# Altium schematic sheet Sheet.SchDoc
size 381 x 241 mm; SheetNumber: 1; SheetTotal: 1
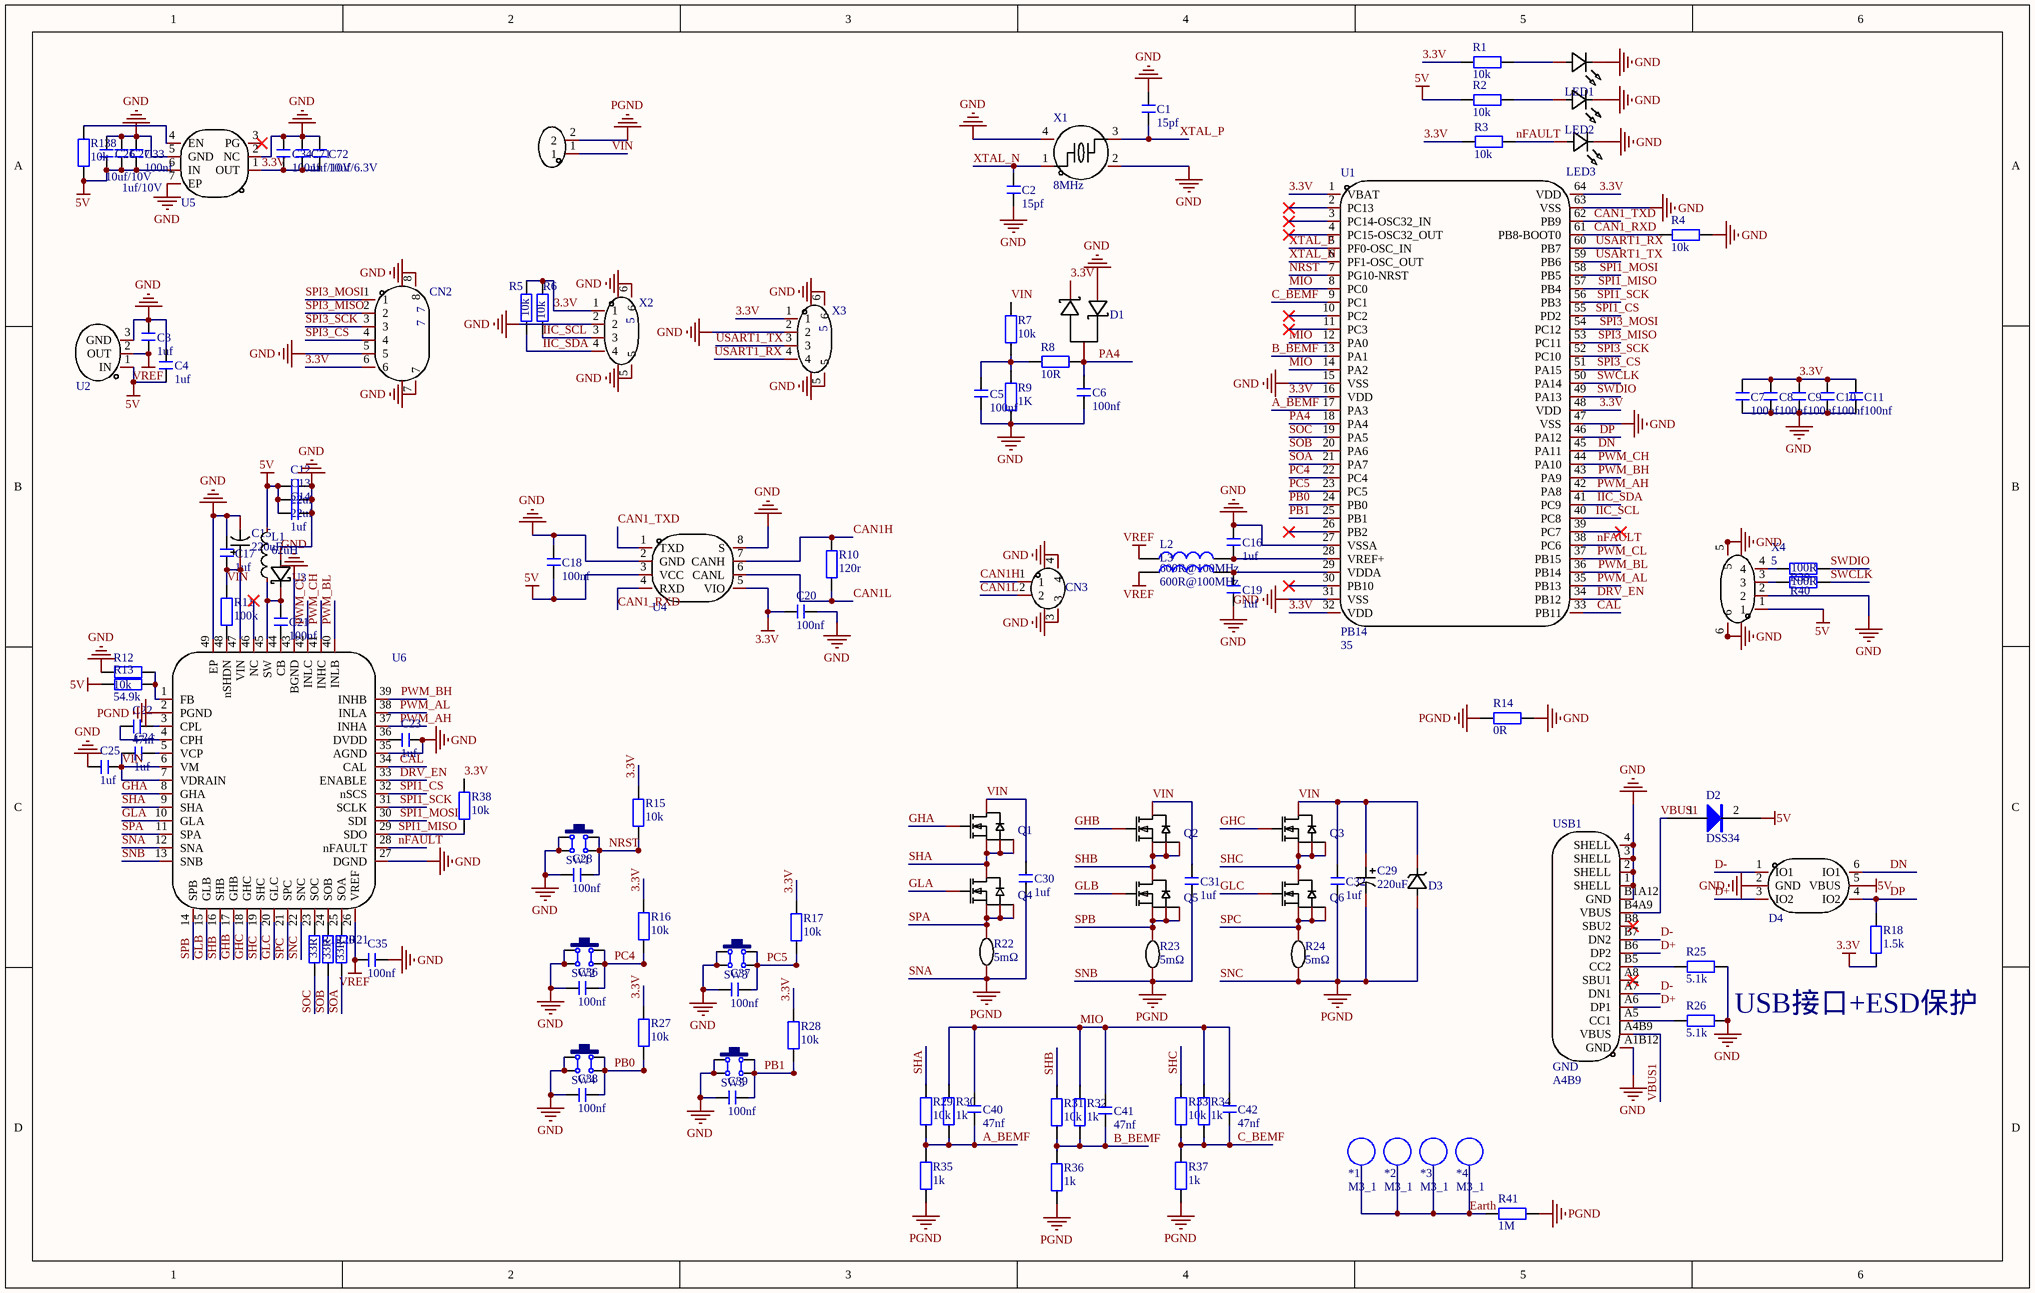
[diagram p0: Sheet.SchDoc]

## Parts
*1  M3_1  [M3 125X250]
*2  M3_1  [M3 125X250]
*3  M3_1  [M3 125X250]
*4  M3_1  [M3 125X250]
C1  15pf  [C0402]
C2  15pf  [C0402]
C3  1uf  [C0402]
C4  1uf  [C0402]
C5  100nf  [C0402]
C6  100nf  [C0402]
C7  100nf  [C0402]
C8  100nf  [C0402]
C9  100nf  [C0402]
C10  100nf  [C0402]
C11  100nf  [C0402]
C12  22uf  [C0402]
C13  22uf  [C0402]
C14  1uf  [C0402]
C15  value 220uF  [CAP 2.5*5*11]  (hidden comment: PA50V220M10x12)
C16  1uf  [C0402]
C17  1uf  [C1206]
C18  100nf  [C0402]
C19  1uf  [C0402]
C20  100nf  [C0402]
C21  100nf  [C0402]
C22  47nf  [C0402]
C23  1uf  [C0402]
C24  1uf  [C0402]
C25  1uf  [C0402]
C26  10uf/10V  [C0603]
C27  1uf/10V  [C0402]
C28  100nf  [C0402]
C29  value 220uF  [CAP-TH_BD10.0-P5.00-D0.6-FD_2]  (hidden comment: PA50V220M10x12)
C30  1uf  [C1206]
C31  1uf  [C1206]
C32  1uf  [C1206]
C33  100nf  [C0402]
C34  100nf  [C0402]
C35  100nf  [C0402]
C36  100nf  [C0402]
C37  100nf  [C0402]
C38  100nf  [C0402]
C39  100nf  [C0402]
C40  47nf  [C0402]
C41  47nf  [C0402]
C42  47nf  [C0402]
C71  1uf/10V  [C0402]
C72  10uf/6.3V  [C0603]
CN1  XT30U-M  [CONN-TH_XT30U-M]  (value not drawn)
CN2  NAME: 7  [CONN-SMD_A1257WR-S-6P]  (hidden comment: A1257WR-S-6P)
CN3  GH125-S02DCA-00  [GH1.25-2P-卧贴]  (value not drawn)
D1  LBAT54SLT1G  [SOT-23_L2.9-W1.3-P1.90-LS2.4-BR]  (value not drawn)
D2  DSS34  [SOD-123]
D3  SMBJ60A_C49066953  [SMB_L4.5-W3.7-LS5.4-RD]  (value not drawn)
D4  USBLC6-2SC6_C2827654  [SOT-23-6_L2.9-W1.6-P0.95-LS2.8-BL]  (value not drawn)
L1  value 62uH  [IND-SMD_L4.0-W4.0_FNR40XXS]  (hidden comment: FNR4020S620MT)
L2  600R@100MHz  [L0603]
L3  600R@100MHz  [L0603]
LED1  XL-1005SURC  [LED0402-R-RD_RED]  (value not drawn)
LED2  XL-1005SURC  [LED0402-R-RD_RED]  (value not drawn)
LED3  XL-1005SURC  [LED0402-R-RD_RED]  (value not drawn)
Q1  NCEP0160AG  [DFN-5_L4.9-W5.9-P1.27-LS6.2-BL]  (value not drawn)
Q2  NCEP0160AG  [DFN-5_L4.9-W5.9-P1.27-LS6.2-BL]  (value not drawn)
Q3  NCEP0160AG  [DFN-5_L4.9-W5.9-P1.27-LS6.2-BL]  (value not drawn)
Q4  NCEP0160AG  [DFN-5_L4.9-W5.9-P1.27-LS6.2-BL]  (value not drawn)
Q5  NCEP0160AG  [DFN-5_L4.9-W5.9-P1.27-LS6.2-BL]  (value not drawn)
Q6  NCEP0160AG  [DFN-5_L4.9-W5.9-P1.27-LS6.2-BL]  (value not drawn)
R1  10k  [R0402]
R2  10k  [R0402]
R3  10k  [R0402]
R4  10k  [R0402]
R5  10k  [R0402]
R6  10k  [R0402]
R7  10k  [R0402]
R8  10R  [R0402]
R9  1K  [R0402]
R10  120r  [R0402]
R11  100k  [R0402]
R12  10k  [R0402]
R13  54.9k  [R0402]
R14  0R  [0805R]
R15  10k  [R0402]
R16  10k  [R0402]
R17  10k  [R0402]
R18  1.5k  [R0402]
R19  33R  [R0402]
R20  33R  [R0402]
R21  33R  [R0402]
R22  value 5mΩ  [R2512]  (hidden comment: HoYLR2512-2W-5mR-1%)
R23  value 5mΩ  [R2512]  (hidden comment: HoYLR2512-2W-5mR-1%)
R24  value 5mΩ  [R2512]  (hidden comment: HoYLR2512-2W-5mR-1%)
R25  5.1k  [R0402]
R26  5.1k  [R0402]
R27  10k  [R0402]
R28  10k  [R0402]
R29  10k  [R0402]
R30  1k  [R0402]
R31  10k  [R0402]
R32  1k  [R0402]
R33  10k  [R0402]
R34  1k  [R0402]
R35  1k  [R0402]
R36  1k  [R0402]
R37  1k  [R0402]
R38  10k  [R0402]
R39  100R  [R0402]
R40  100R  [R0402]
R41  1M  [0805R]
R138  10k  [R0402]
SW1  smd-4*4*1.5  [TSW SMD-4*4*1.5]  (value not drawn)
SW2  smd-4*4*1.5  [TSW SMD-4*4*1.5]  (value not drawn)
SW3  smd-4*4*1.5  [TSW SMD-4*4*1.5]  (value not drawn)
SW4  smd-4*4*1.5  [TSW SMD-4*4*1.5]  (value not drawn)
SW5  smd-4*4*1.5  [TSW SMD-4*4*1.5]  (value not drawn)
U1  NAME: PB14  NUMBER: 35  [LQFP-64_L10.0-W10.0-P0.50-LS12.0-BL]  (hidden comment: STM32G474RET6)
U2  REF3033AIDBZR  [SOT-23-3_L3.0-W1.7-P0.95-LS2.9-BR]  (value not drawn)
U3  DSK16_C22466351  [SOD-123FL_L2.8-W1.9-LS3.7-RD]  (value not drawn)
U4  TJA1051T/3  [SOP-8_L4.9-W3.9-P1.27-LS6.0-BL-1]  (value not drawn)
U5  LP5912-3.3DRVR  [WSON-6_L2.0-W2.0-P0.65-TL-EP]  (value not drawn)
U6  DRV8323RSRGZT  [VQFN-48_L7.0-W7.0-P0.50-BL-EP5.5]  (value not drawn)
USB1  NAME: GND  NUMBER: A4B9  [USB-C-SMD_TYPE-C16PIN]  (hidden comment: TYPE-C16PIN)
X1  value 8MHz  [CRYSTAL-SMD_4P-L3.2-W2.5-BL]  (hidden comment: XL2EL89CSI-111YLC-25M)
X2  NUMBER: 5  [GH1.25-4P-卧贴]  (hidden comment: GH125-S04CCA-00)
X3  NUMBER: 5  [GH1.25-4P-卧贴]  (hidden comment: GH125-S04CCA-00)
X4  NUMBER: 5  [GH1.25-4P-卧贴]  (hidden comment: GH125-S04CCA-00)

## Nets
3.3V: C7.1 C8.1 C9.1 C10.1 C11.1 C20.2 C34.2 C71.2 C72.2 CN2.6 D1.2(K) R1.2 R3.2 R5.2 R6.2 R15.2 R16.2 R17.2 R18.2 R27.2 R28.2 R38.2 U1.1(VBAT) U1.16(VDD) U1.32(VDD) U1.48(VDD) U1.64(VDD) U4.5(VIO) U5.1(OUT) X2.1 X3.1
5V: C4.1 C12.1 C13.1 C14.1 C18.2 C26.2 C27.2 C33.2 D2.2 D4.5(VBUS) L1.2 R2.2 R13.1 R138.1 U2.1(IN) U4.3(VCC) U5.6(IN) X4.1
GND: C1.1 C2.2 C3.2 C4.2 C5.2 C6.2 C7.2 C8.2 C9.2 C10.2 C11.2 C12.2 C13.2 C14.2 C15.2 C16.1 C17.2 C18.1 C19.2 C20.1 C23.2 C25.1 C26.1 C27.1 C28.1 C33.1 C34.1 C35.2 C36.1 C37.1 C38.1 C39.1 C71.1 C72.1 CN2.5 CN2.7 CN2.8 CN3.3 CN3.4 D1.1(A) D4.2(GND) LED1.2(A) LED2.2(A) LED3.2(A) R4.1 R9.1 R12.1 R14.2 R25.1 R26.1 SW1.1 SW1.4 SW2.1 SW2.4 SW3.1 SW3.4 SW4.1 SW4.4 SW5.1 SW5.4 U1.15(VSS) U1.27(VSSA) U1.31(VSS) U1.47(VSS) U1.63(VSS) U2.3(GND) U3.2(A) U4.2(GND) U4.8(S) U5.2(NC) U5.5(GND) U5.7(EP) U6.27(DGND) U6.35(AGND) U6.43(BGND) U6.49(EP) USB1.1(SHELL) USB1.2(SHELL) USB1.3(SHELL) USB1.4(SHELL) USB1.A1B12(GND) USB1.B1A12(GND) X1.2(GND) X1.4(GND) X2.2 X2.5 X2.6 X3.2 X3.5 X3.6 X4.2 X4.5 X4.6
SNA: C29.2 C30.1 C31.1 C32.1 CN1.2 D3.2(A) R14.1 R22.1 R23.1 R24.1 R35.1 R36.1 R37.1 R41.1 U6.2(PGND) U6.12(SNA) U6.13(SNB) U6.22(SNC)  [also labelled PGND, SNB, SNC]
VREF: C3.1 C35.1 L2.1 L3.1 U2.2(OUT) U6.26(VREF)
A_BEMF: C40.1 R29.1 R30.1 R35.2 U1.17(PA3)
B_BEMF: C41.1 R31.1 R32.1 R36.2 U1.13(PA1)
C_BEMF: C42.1 R33.1 R34.1 R37.2 U1.9(PC1)
CAL: U1.33(PB11) U6.34(CAL)
CAN1_RXD: R4.2 U1.61(PB8-BOOT0) U4.4(RXD)
CAN1_TXD: U1.62(PB9) U4.1(TXD)
CAN1H: CN3.1 R10.2 U4.7(CANH)
CAN1L: CN3.2 R10.1 U4.6(CANL)
D+: D4.3(IO2) USB1.A6(DP1) USB1.B6(DP2)
D-: D4.1(IO1) USB1.A7(DN1) USB1.B7(DN2)
DN: D4.6(IO1) U1.45(PA11)
DP: D4.4(IO2) R18.1 U1.46(PA12)
DRV_EN: U1.34(PB12) U6.33(ENABLE)
Earth: *1.1 *2.1 *3.1 *4.1 R41.2
GHA: Q1.4(G) U6.8(GHA)
GHB: Q2.4(G) U6.17(GHB)
GHC: Q3.4(G) U6.18(GHC)
GLA: Q4.4(G) U6.10(GLA)
GLB: Q5.4(G) U6.15(GLB)
GLC: Q6.4(G) U6.20(GLC)
IIC_SCL: R6.1 U1.40(PC8) X2.3
IIC_SDA: R5.1 U1.41(PC9) X2.4
MIO: C40.2 C41.2 C42.2 R30.2 R32.2 R34.2 U1.8(PC0) U1.12(PA0) U1.14(PA2)
nFAULT: LED3.1(K) R3.1 U1.38(PC6) U6.28(nFAULT)
NRST: C28.2 R15.1 SW1.2 SW1.3 U1.7(PG10-NRST)
PA4: C6.1 D1.3(AK) R8.1 U1.18(PA4)
PB0: C38.2 R27.1 SW4.2 SW4.3 U1.24(PB0)
PB1: C39.2 R28.1 SW5.2 SW5.3 U1.25(PB1)
PC4: C36.2 R16.1 SW2.2 SW2.3 U1.22(PC4)
PC5: C37.2 R17.1 SW3.2 SW3.3 U1.23(PC5)
PWM_AH: U1.42(PA8) U6.37(INHA)
PWM_AL: U1.35(PB13) U6.38(INLA)
PWM_BH: U1.43(PA9) U6.39(INHB)
PWM_BL: U1.36(PB14) U6.40(INLB)
PWM_CH: U1.44(PA10) U6.41(INHC)
PWM_CL: U1.37(PB15) U6.42(INLC)
SHA: Q1.1(S) Q1.2(S) Q1.3(S) Q4.5(D) R29.2 U6.9(SHA)
SHB: Q2.1(S) Q2.2(S) Q2.3(S) Q5.5(D) R31.2 U6.16(SHB)
SHC: Q3.1(S) Q3.2(S) Q3.3(S) Q6.5(D) R33.2 U6.19(SHC)
SOA: R21.1 U1.21(PA7)
SOB: R20.1 U1.20(PA6)
SOC: R19.1 U1.19(PA5)
SPA: Q4.1(S) Q4.2(S) Q4.3(S) R22.2 U6.11(SPA)
SPB: Q5.1(S) Q5.2(S) Q5.3(S) R23.2 U6.14(SPB)
SPC: Q6.1(S) Q6.2(S) Q6.3(S) R24.2 U6.21(SPC)
SPI1_CS: U1.55(PD2) U6.32(nSCS)
SPI1_MISO: R38.1 U1.57(PB4) U6.29(SDO)
SPI1_MOSI: U1.58(PB5) U6.30(SDI)
SPI1_SCK: U1.56(PB3) U6.31(SCLK)
SPI3_CS: CN2.4 U1.51(PA15)
SPI3_MISO: CN2.2 U1.53(PC11)
SPI3_MOSI: CN2.1 U1.54(PC12)
SPI3_SCK: CN2.3 U1.52(PC10)
SWCLK: R40.2 U1.50(PA14)
SWDIO: R39.2 U1.49(PA13)
USART1_RX: U1.60(PB7) X3.4
USART1_TX: U1.59(PB6) X3.3
VBUS1: D2.1 USB1.A4B9(VBUS) USB1.B4A9(VBUS)
VIN: C15.1 C17.1 C24.1 C25.2 C29.1 C30.2 C31.2 C32.2 CN1.1 D3.1(K) Q1.5(D) Q2.5(D) Q3.5(D) R7.2 R11.2 U6.6(VM) U6.7(VDRAIN) U6.47(VIN)
XTAL_N: C2.1 U1.6(PF1-OSC_OUT) X1.1
XTAL_P: C1.2 U1.5(PF0-OSC_IN) X1.3
NetC5_1: C5.1 R7.1 R8.2 R9.2
NetC16_2: C16.2 L2.2 U1.28(VREF+)
NetC19_1: C19.1 L3.2 U1.29(VDDA)
NetC21_1: C21.1 U6.44(CB)
NetC21_2: C21.2 L1.1 U3.1(K) U6.45(SW)
NetC22_1: C22.1 U6.4(CPH)
NetC22_2: C22.2 U6.3(CPL)
NetC23_1: C23.1 U6.36(DVDD)
NetC24_2: C24.2 U6.5(VCP)
NetLED1_1: LED1.1(K) R1.1
NetLED2_1: LED2.1(K) R2.1
NetR11_1: R11.1 U6.48(nSHDN)
NetR12_2: R12.2 R13.2 U6.1(FB)
NetR19_2: R19.2 U6.23(SOC)
NetR20_2: R20.2 U6.24(SOB)
NetR21_2: R21.2 U6.25(SOA)
NetR25_2: R25.2 USB1.B5(CC2)
NetR26_2: R26.2 USB1.A5(CC1)
NetR39_1: R39.1 X4.4
NetR40_1: R40.1 X4.3
NetR138_2: R138.2 U5.4(EN)

Not connected (* = marked no-connect by the designer): U1 2(PC13)* 3(PC14-OSC32_IN)* 4(PC15-OSC32_OUT)* 10(PC2)* 11(PC3)* 26(PB2)* 30(PB10)* 39(PC7)*; U5 3(PG)*; U6 46(NC)*; USB1 A8(SBU1)* B8(SBU2)*

## Notes on the sheet
- USB接口+ESD保护

## Library data of the parts
*1-*4 = M3_1: 铜柱孔; 版权归属: 源创客; BOM名称: 铜柱孔; 学习资源: www.ooocke.com
C1-C14 C16-C28 C30-C42 C71 C72 = C: 无极性电容; BOM名称: 无极性贴片电容; 版权归属: 源创客; 学习资源: www.ooocke.com
C15 C29 = 电解电容M10*12: 容值:220uF;精度:±20%;额定电压:50V;纹波电流:3.5A@100kHz;等效串联电阻(ESR):20mΩ@100kHz;类型:聚合物;; Manufacturer: JIERR(捷而瑞); Add into BOM: yes; Tolerance: ±20%; Voltage Rating: 50V; Type: 聚合物; Lifetime: 2000hrs@105; Symbol: PA50V220M10X12; Device: PA50V220M10x12; LCSC Part Name: 220uF ±20% 50V; Supplier Part: C46550451; Manufacturer Part: PA50V220M10x12; Supplier Footprint: 插件,D10xL12.5mm; JLCPCB Part Class: Extended Part; Datasheet: https://item.szlcsc.com/datasheet/PA50V220M10x12/48680145.html; Supplier: LCSC; Convert to PCB: yes; Ripple Current: 3.5A@100kHz; Equivalent Series Resistance(ESR): 20mΩ@100kHz; Diameter: 10mm; Height - Seated (Max): 12.5mm; Operating Temperature: -55~+105
CN1 = XT30U-M: Manufacturer: AMASS(艾迈斯); Add into BOM: yes; Name: XT30U-M; Symbol: XT30U-M; Device: XT30U-M; LCSC Part Name: XT30U-M 公头; Supplier Part: C99101; Manufacturer Part: XT30U-M; Supplier Footprint: -; JLCPCB Part Class: Extended Part; Datasheet: https://atta.szlcsc.com/upload/public/pdf/source/20170606/1496716542582.pdf; Supplier: LCSC; Convert to PCB: yes
CN2 = GH1.25-6P: 插针结构:1x6P;间距:1.25mm;安装方式:-;行距:-;总PIN数:6P;排数:1;每排PIN数:6;参考系列:GH;触头材质:黄铜;; Manufacturer: CJT(长江连接器); Add into BOM: yes; Pins Structure: 1x6P; Pitch: 1.25mm; Number of PINs Per Row: 6; Reference Series: GH; Symbol: A1257WR-S-6P; Device: A1257WR-S-6P; LCSC Part Name: 1x6P 间距:1.25mm 系列:GH 镀锡; Supplier Part: C225129; Manufacturer Part: A1257WR-S-6P; Supplier Footprint: SMD,P=1.25mm; JLCPCB Part Class: Extended Part; Datasheet: https://atta.szlcsc.com/upload/public/pdf/source/20181008/C272994_C9E89FA8A36D0009CAD30AD8C59C2782.pdf; Supplier: LCSC; Convert to PCB: yes; Mounting Style: -; Row Spacing: -; Number of Pins: 6P; Number of Rows: 1; Contact Material: 黄铜; NUMBER: 7
CN3 = GH125-2p: Manufacturer: JS(钜硕电子); Add into BOM: yes; Pitch: 1.25mm; Pins Structure: 1x2P; Number of PINs Per Row: 2; Gender: 公型插针; Current Rating (Max): 1A; Name: GH125-S02DCA-00; Symbol: GH125-S02DCA-00; Device: GH125-S02DCA-00; LCSC Part Name: GH1.25卧式贴片 带扣; Supplier Part: C2886765; Manufacturer Part: GH125-S02DCA-00; Supplier Footprint: SMD,P=1.25mm; JLCPCB Part Class: Extended Part; Datasheet: https://atta.szlcsc.com/upload/public/pdf/source/20210818/CD11791E5ED3EDF45A7009E9C8A2BD4C.pdf; Supplier: LCSC; Convert to PCB: yes; Reference Series: -; Number of Rows: 1; Row Spacing: -; Mounting Style: 卧贴; Operating Temperature Range: -25℃~+85℃
D1 = LBAT54SLT1G: 正向压降(Vf):400mV;直流反向耐压(Vr):30V;整流电流:200mA;; Manufacturer: LRC(乐山无线电); Add into BOM: yes; Voltage - Forward(Vf@If): 400mV; Voltage - DC Reverse(Vr): 30V; Current - Rectified: 200mA; Reverse Leakage Current (Ir): 2uA; Non-Repetitive Peak Forward Surge Current: 600mA; Symbol: LBAT54SLT1G; Device: LBAT54SLT1G; LCSC Part Name: 电压:30V 电流:200mA; Supplier Part: C12765; Manufacturer Part: LBAT54SLT1G; Supplier Footprint: SOT-23; JLCPCB Part Class: Extended Part; Datasheet: https://item.szlcsc.com/datasheet/LBAT54SLT1G/13406.html; Supplier: LCSC; Convert to PCB: yes
D2 = 二极管: Diode 1N series
D3 = SMBJ60A_C49066953: 极性:单向;反向截止电压(Vrwm):60V;钳位电压:96.8V;峰值脉冲电流(Ipp):6.2A;峰值脉冲功率(Ppp):600W;击穿电压:73.7V;; Manufacturer: R+O(宏嘉诚); Add into BOM: yes; Polarity: 单向; Reverse Stand-Off Voltage (Vrwm): 60V; Clamping Voltage: 96.8V; Peak Pulse Current (Ipp): 6.2A; Peak Pulse Power Dissipation (Ppp): 600W; Voltage - Breakdown: 73.7V; Reverse Leakage Current (Ir): 5uA; Number of Channels: 单路; level of protection: IEC 61000-4-2; Type: TVS; Symbol: SMBJ60A_C49066953; Device: SMBJ60A_C49066953; LCSC Part Name: 单向TVS 60V截止 峰值浪涌电流：6.2A; Supplier Part: C49066953; Manufacturer Part: SMBJ60A; Supplier Footprint: SMB(DO-214AA); Datasheet: https://item.szlcsc.com/datasheet/SMBJ60A/51438149.html; Supplier: LCSC; Convert to PCB: yes; Operating Temperature: -55~+150
D4 = USBLC6-2SC6_C2827654: 极性:-;反向截止电压(Vrwm):-;最大钳位电压:-;峰值脉冲电流(Ipp)@10/1000us:-;峰值脉冲功率(Ppp)@10/1000us:-;击穿电压:-;; Manufacturer: TECH PUBLIC(台舟); Add into BOM: yes; Type: ESD; Symbol: USBLC6-2SC6_C2827654; Device: USBLC6-2SC6_C2827654; LCSC Part Name: ESD，可防30kV静电; Supplier Part: C2827654; Manufacturer Part: USBLC6-2SC6; Supplier Footprint: SOT-23-6; Datasheet: https://atta.szlcsc.com/upload/public/pdf/source/20210810/FBD75DE717D6D97BAC6DD7F2B5C09DCD.pdf; Supplier: LCSC; Convert to PCB: yes; polarity: -; Reverse Stand-Off Voltage (Vrwm): -; Maximum Clamping Voltage: -; Peak Pulse Current (Ipp)@10/1000us: -; Peak Pulse Power Dissipation (Ppp)@10/1000us: -; Breakdown Voltage: -; Reverse Leakage Current (Ir): -; Operating Temperature: -
L1 = FNR4020S620MT: 电感值:62uH;精度:±20%;额定电流:520mA;饱和电流(Isat):710mA;类型:磁胶屏蔽电感;; Manufacturer: cjiang(长江微电); Add into BOM: yes; Tolerance: ±20%; Current Rating: 520mA; Current - Saturation(Isat): 710mA; DC Resistance(DCR): 1.17Ω; Type: 磁胶屏蔽电感; Symbol: FNR4020S620MT; Device: FNR4020S620MT; LCSC Part Name: 62uH ±20% 710mA; Supplier Part: C167846; Manufacturer Part: FNR4020S620MT; Supplier Footprint: SMD,4x4mm; JLCPCB Part Class: Extended Part; Datasheet: https://item.szlcsc.com/datasheet/FNR4020S620MT/179229.html; Supplier: LCSC; Convert to PCB: yes
L2 L3 = L_1: 电感; BOM名称: 小功率贴片电感; 版权归属: 源创客; 学习资源: www.ooocke.com
LED1-LED3 = LED_1: 发光颜色:红色;功率:55mW;正向电流:25mA;主波长:620nm;透镜颜色:无色透明透镜;色温:6000K~7000K;发光角度:120°;载带方式:正贴;工作温度:-30~+85;; Manufacturer: XINGLIGHT(成兴光); Add into BOM: yes; Emitted Color: 红色; Power Dissipation: 55mW; Forward Current: 25mA; Dominant Wavelength: 620nm; Peak Wavelength: 625nm; Lens Color: 无色透明透镜; Viewing Angle: 120°; Mounting Sytle: 正贴; Symbol: XL-1005SURC; Device: XL-1005SURC; LCSC Part Name: XL-1005SURC; Supplier Part: C965790; Manufacturer Part: XL-1005SURC; Supplier Footprint: 0402; JLCPCB Part Class: Extended Part; Datasheet: https://atta.szlcsc.com/upload/public/pdf/source/20221102/EBA3AB29C2D5B62EE70B36967F8F8809.pdf; Supplier: LCSC; Convert to PCB: yes; Color Temperature: 6000K~7000K; Operating Temperature: -30~+85
Q1-Q6 = NCEP0160AG: 数量:1个N沟道;漏源电压(Vdss):100V;连续漏极电流(Id):60A;导通电阻(RDS(on)):11mΩ@4.5V,30A;耗散功率(Pd):105W;阈值电压(Vgs(th)):1V;; Manufacturer: NCE(无锡新洁能); Add into BOM: yes; Number: 1个N沟道; Drain to Source Voltage: 100V; Current - Continuous Drain(Id): 60A; Pd - Power Dissipation: 105W; Gate Threshold Voltage (Vgs(th)): 1V; Gate Charge(Qg): 65nC@50V; Input Capacitance(Ciss): 4.2nF@50V; Reverse Transfer Capacitance (Crss@Vds): 23pF; Symbol: NCEP0160AG; Device: NCEP0160AG; LCSC Part Name: 1个N沟道 耐压:100V 电流:60A; Supplier Part: C503012; Manufacturer Part: NCEP0160AG; Supplier Footprint: DFN5X6-8L; JLCPCB Part Class: Extended Part; Datasheet: https://item.szlcsc.com/datasheet/NCEP0160AG/515533.html; Supplier: LCSC; Convert to PCB: yes; RDS(on): 11mΩ@4.5V,30A; Operating Temperature: -55~+150
R1-R21 R25-R41 R138 = R: 电阻; BOM名称: 贴片电阻; 版权归属: 源创客; 学习资源: www.ooocke.com
R22-R24 = HoYLR2512-2W-5mR-1%: 电阻类型:采样电阻;阻值:5mΩ;精度:±1%;功率:2W;安装方式:贴片;; Manufacturer: Milliohm(毫欧); Add into BOM: yes; Tolerance: ±1%; Power(Watts): 2W; Mounting Sytle: 贴片; Symbol: HOYLR2512-2W-5MR-1%; Device: HoYLR2512-2W-5mR-1%; LCSC Part Name: 5mΩ ±1% 2W; Supplier Part: C5375417; Manufacturer Part: HoYLR2512-2W-5mR-1%; Supplier Footprint: 2512; JLCPCB Part Class: Extended Part; Datasheet: https://atta.szlcsc.com/upload/public/pdf/source/20230506/030C75DA7C4694D1A0A3C5A1E352E2F2.pdf; Supplier: LCSC; Convert to PCB: yes; Type: 采样电阻
SW1-SW5 = TSW DIP-6x6: 轻触开关; BOM名称: 直插6x6轻触开关; 版权归属: 源创客; 学习资源: www.ooocke.com
U1 = STM32G474RET6: CPU内核:ARM-M4;CPU最大主频:170MHz;应用领域:-;; Manufacturer: ST(意法半导体); Add into BOM: yes; CPU Core: ARM-M4; CPU Maximum Speed: 170MHz; Program Storage Size: 512KB; Program Memory Type: FLASH; Number of I/O: 52; ADC (Bit): 12bit; Voltage - Supply: 1.71V~3.6V; Symbol: STM32G474RET6; Device: STM32G474RET6; LCSC Part Name: 带DSP和FPU的170MHz主流ARM Cortex-M4 MCU，具有512 KB Flash存储器、数学加速器、高分辨率定时器和高模拟电平集成; Supplier Part: C521608; Manufacturer Part: STM32G474RET6; Supplier Footprint: LQFP-64(10x10); JLCPCB Part Class: Extended Part; Datasheet: https://item.szlcsc.com/datasheet/STM32G474RET6/538858.html; Supplier: LCSC; Convert to PCB: yes; DAC (Bit): 12bit; Applications: -
U2 = REF3033AIDBZR: 输出类型:固定;工作电压:3.35V~5.5V;输出电压:3.3V;输出电流:25mA;精度:±0.2%;; Manufacturer: TI(德州仪器); Add into BOM: yes; Output Type: 固定; Output Voltage: 3.3V; Output Current: 25mA; Tolerance: ±0.2%; Temperature Coefficient: 75ppm/; Reference Type: 串联; Quiescent Current: 50uA; Noise - 1/10Hz to 10Hz: 36uVp-p; Noise - 10Hz to 10kHz: 105uVrms; Symbol: REF3033AIDBZR; Device: REF3033AIDBZR; LCSC Part Name: 3.35V~5.5V 串联 50uA 75ppm/; Supplier Part: C36658; Manufacturer Part: REF3033AIDBZR; Supplier Footprint: SOT-23; JLCPCB Part Class: Extended Part; Datasheet: https://www.ti.com/lit/ds/symlink/ref30.pdf; Supplier: LCSC; Convert to PCB: yes; Voltage - Supply: 3.35V~5.5V; Minimum Cathode Current for Regulation: -; Operating Temperature: -40~+125@(Ta)
U3 = DSK16_C22466351: 二极管配置:独立式;正向压降(Vf):700mV@1A;直流反向耐压(Vr):60V;整流电流:1A;; Manufacturer: R+O(宏嘉诚); Manufacturer Part: DSK16; Add into BOM: yes; Diode Configuration: 独立式; Voltage - DC Reverse(Vr): 60V; Current - Rectified: 1A; Reverse Leakage Current (Ir): 200uA@60V; Operating Junction Temperature Range: -55~+150; Non-Repetitive Peak Forward Surge Current: 25A; Symbol: DSK16_C22466351; Device: DSK16_C22466351; LCSC Part Name: 电压:60V 电流:1A; Supplier Part: C22466351; Supplier Footprint: SOD-123FL; JLCPCB Part Class: Extended Part; Datasheet: https://item.szlcsc.com/datasheet/DSK16/24165510.html; Supplier: LCSC; Convert to PCB: yes; Voltage - Forward(Vf@If): 700mV@1A
U4 = TJA1051T/3: Manufacturer: Tokmas(托克马斯); Add into BOM: yes; Symbol: TJA1051T/3; Device: TJA1051T/3; LCSC Part Name: CAN芯片; Supplier Part: C5342108; Manufacturer Part: TJA1051T/3; Supplier Footprint: SOP-8; JLCPCB Part Class: Extended Part; Datasheet: https://atta.szlcsc.com/upload/public/pdf/source/20221230/A2F88B671123D34174A4F40D8F54A86B.pdf; Supplier: LCSC; Convert to PCB: yes
U5 = LP5912-3.3DRVR: 输出类型:固定;最大输入电压:6.5V;输出电压:3.3V;输出电流:500mA;输出极性:正极;; Manufacturer: TI(德州仪器); Add into BOM: yes; Output Type: 固定; Maximum Input Voltage: 6.5V; Output Voltage: 3.3V; Output Current: 500mA; Dropout Voltage: 180mV@(500mA); standby current: 55uA; Output Polarity: 正极; Number of Outputs: 1; Symbol: LP5912-3.3DRVR; Device: LP5912-3.3DRVR; LCSC Part Name: 具有反向电流保护功能的 500mA、低噪声、低 IQ、低压降稳压器; Supplier Part: C524780; Manufacturer Part: LP5912-3.3DRVR; Supplier Footprint: WSON-6-EP(2x2); JLCPCB Part Class: Extended Part; Datasheet: https://www.ti.com/cn/lit/gpn/lp5912; Supplier: LCSC; Convert to PCB: yes; Feature: 防静电保护；短路保护；自动放电功能；低ESR；热保护(TSD)；欠压闭锁；过流保护(OCP)；带使能；防倒灌; Operating Temperature: -40~+125@(Tj)
U6 = DRV8323RSRGZT: DRV8323R 具有降压稳压器和电流分流放大器的最大 65V 三相智能栅极驱动器; Manufacturer: TI(德州仪器); Add into BOM: yes; Peak Current: 2A；1A; Interface: SPI; Symbol: DRV8323RSRGZT; Device: DRV8323RSRGZT; LCSC Part Name: 5mA 无刷直流BLDC电机驱动芯片 60V; Supplier Part: C2653553; Manufacturer Part: DRV8323RSRGZT; Supplier Footprint: VQFN-48-EP(7x7); JLCPCB Part Class: Extended Part; Datasheet: https://www.ti.com/cn/lit/gpn/drv8323r; Supplier: LCSC; Convert to PCB: yes; Voltage - Supply: -; Operating Temperature: -40~+125
USB1 = TYPE-C16PIN: 连接器类型:Type-C;标准:-;公母:母;端口数量:1;触点数量:16P;安装方式:卧贴;额定电流 - 电源:3A;工作温度范围:-40~+85;; Manufacturer: SHOU HAN(首韩); Add into BOM: yes; Connector Type: Type-C; Gender: 母; Number of Ports: 1; Number of Contacts: 16P; Current Rating - Power (Max): 3A; Symbol: TYPE-C16PIN; Device: TYPE-C16PIN; LCSC Part Name: Type-C 母 卧贴; Supplier Part: C393939; Manufacturer Part: TYPE-C16PIN; Supplier Footprint: SMD; JLCPCB Part Class: Extended Part; Datasheet: https://atta.szlcsc.com/upload/public/pdf/source/20190521/C393939_7B9043D4CF1026AF443AB60D91FBCD5C.pdf; Supplier: LCSC; Convert to PCB: yes; Standard: -; Mounting Style: 卧贴; Operating Temperature Range: -40~+85
X1 = XL2EL89CSI-111YLC-25M: 频率:16MHz;负载电容:12pF;频率公差:±10ppm;; Manufacturer: YXC(扬兴晶振); Add into BOM: yes; Crystal Type: 贴片无源晶振; Load Capacitance: 20pF; Frequency Tolerance: ±10ppm; Symbol: XL2EL89CSI-111YLC-25M; Device: XL2EL89CSI-111YLC-25M; LCSC Part Name: 25MHz ±10ppm 20pF YSX321SL; Supplier Part: C5280577; Manufacturer Part: XL2EL89CSI-111YLC-25M; Supplier Footprint: SMD3225-4P; JLCPCB Part Class: Extended Part; Datasheet: https://atta.szlcsc.com/upload/public/pdf/source/20221123/8DAA01809C4E3F159850A71277C18D74.pdf; Supplier: LCSC; Convert to PCB: yes
X2-X4 = GH1.25-4P_1: 插针结构:1x4P;间距:1.25mm;安装方式:立贴;行距:-;总PIN数:4P;排数:1;每排PIN数:4;参考系列:-;额定电流:1A;工作温度范围:-25~+85;; Manufacturer: JS(钜硕电子); Add into BOM: yes; Pins Structure: 1x4P; Pitch: 1.25mm; Number of PINs Per Row: 4; Current Rating (Max): 1A; Symbol: GH125-S04CCA-00; Device: GH125-S04CCA-00; LCSC Part Name: 1x4P 间距:1.25mm 立贴 带扣; Supplier Part: C2886782; Manufacturer Part: GH125-S04CCA-00; Supplier Footprint: SMD,P=1.25mm; JLCPCB Part Class: Extended Part; Datasheet: https://atta.szlcsc.com/upload/public/pdf/source/20210818/35C7AE18760A04DD9417CB3CEC0962A3.pdf; Supplier: LCSC; Convert to PCB: yes; Mounting Style: 立贴; Row Spacing: -; Number of Pins: 4P; Number of Rows: 1; Reference Series: -; Operating Temperature Range: -25~+85